# EAGLE design smd_transistor_adapter (EAGLE 7.4.0)
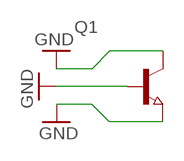
[diagram p0: schematic, sheet 1]

## Parts
Q1  NPN-TRANSISTOR_SOT23  [SOT23]

## Nets
COLLECTOR: Q1.1(B) Q1.2(E) Q1.3(C) ; supply symbol labelled GND

## Library data of the parts
Q1 = semicon-smd-ipc:NPN-TRANSISTOR_: NPN TRANSISTOR

## Board
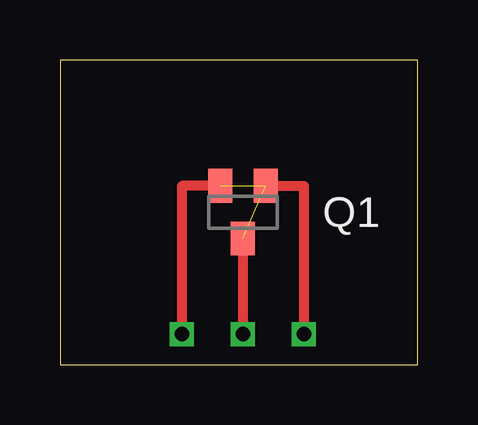
[diagram p1: board, top side]

Size 14.91 x 12.69 mm. Coordinates in mm from the lower left corner, seen from the top.
Outline: 0,0 14.91,0 14.91,12.69 0,12.69 0,0
Copper layers (1*16): Top 0.035mm / dielectric 1.5mm / Bottom 0.035mm
Design rules "default": minimum track width 10mil, minimum drill 24mil, track to track 8mil, track to pad 8mil, pad to pad 8mil, via to via 8mil, smd to smd 8mil, copper to edge 40mil, drill to drill 8mil, minimum pad ring 10mil, minimum via ring 8mil, stop-mask expansion 4mil, vias tented up to drill 0mil, thermal gap 10mil

### Footprints (pad centres in the part's own frame; a part is rotated, then mirrored left to right if it is on the bottom)
SOT23 = smd 1 x 1.4: 1 -0.95,-1.1; 2 0.95,-1.1; 3 0,1.1

### Placement (x,y rotation side)
Q1  7.62,6.35 180 top

### Tracks (layer width: path | path; a pad name or v marks a point on that pad's centre or on a via)
COLLECTOR  (via drill 0.6)  (2 unrouted)
  Top 0.406: Q1.3 v7.62,1.27 | Q1.1 10.16,7.45 v10.16,1.27 | Q1.2 5.08,7.45 v5.08,1.27